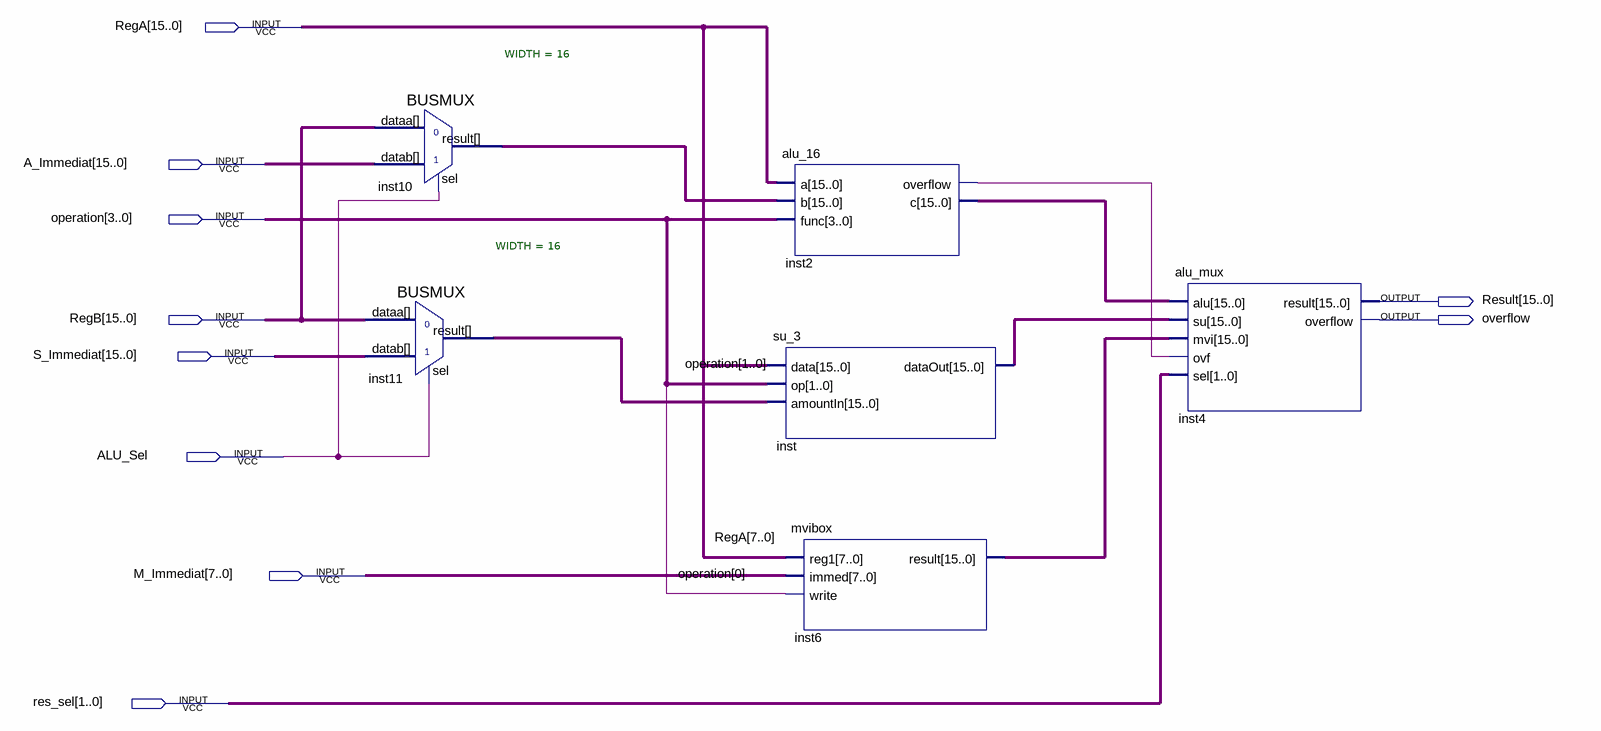
[diagram p0: schematic sheet]
// Quartus schematic ALU_1.bdf as structural Verilog: 6 symbols, 10 pins
module ALU_1 (
  input  [15:0] RegA,
  input  [15:0] A_Immediat,
  input  [3:0] operation,
  input  [15:0] RegB,
  input  [15:0] S_Immediat,
  input  ALU_Sel,
  input  [7:0] M_Immediat,
  input  [1:0] res_sel,
  output [15:0] Result,
  output overflow
);

  wire inst2_overflow;
  wire [15:0] inst2_c, inst6_result, inst10_result, inst11_result, inst_dataout;

  BUSMUX #(.WIDTH(16)) inst10 (.datab(A_Immediat), .sel(ALU_Sel), .dataa(RegB), .result(inst10_result));
  BUSMUX #(.WIDTH(16)) inst11 (.datab(S_Immediat), .sel(ALU_Sel), .dataa(RegB), .result(inst11_result));
  alu_16 inst2 (.a(RegA), .b(inst10_result), .func(operation), .overflow(inst2_overflow), .c(inst2_c));
  su_3 inst (.data(RegA), .op(operation[1:0]), .amountIn(inst11_result), .dataOut(inst_dataout));
  mvibox inst6 (.reg1(RegA[7:0]), .immed(M_Immediat), .write(operation[0]), .result(inst6_result));
  alu_mux inst4 (
    .alu(inst2_c), .su(inst_dataout), .mvi(inst6_result), .ovf(inst2_overflow), .sel(res_sel),
    .result(Result), .overflow(overflow));
endmodule
